# EAGLE schematic BottomBoard_Imu_Arduinio (EAGLE 9.4.2)

## Sheet 1 of 2
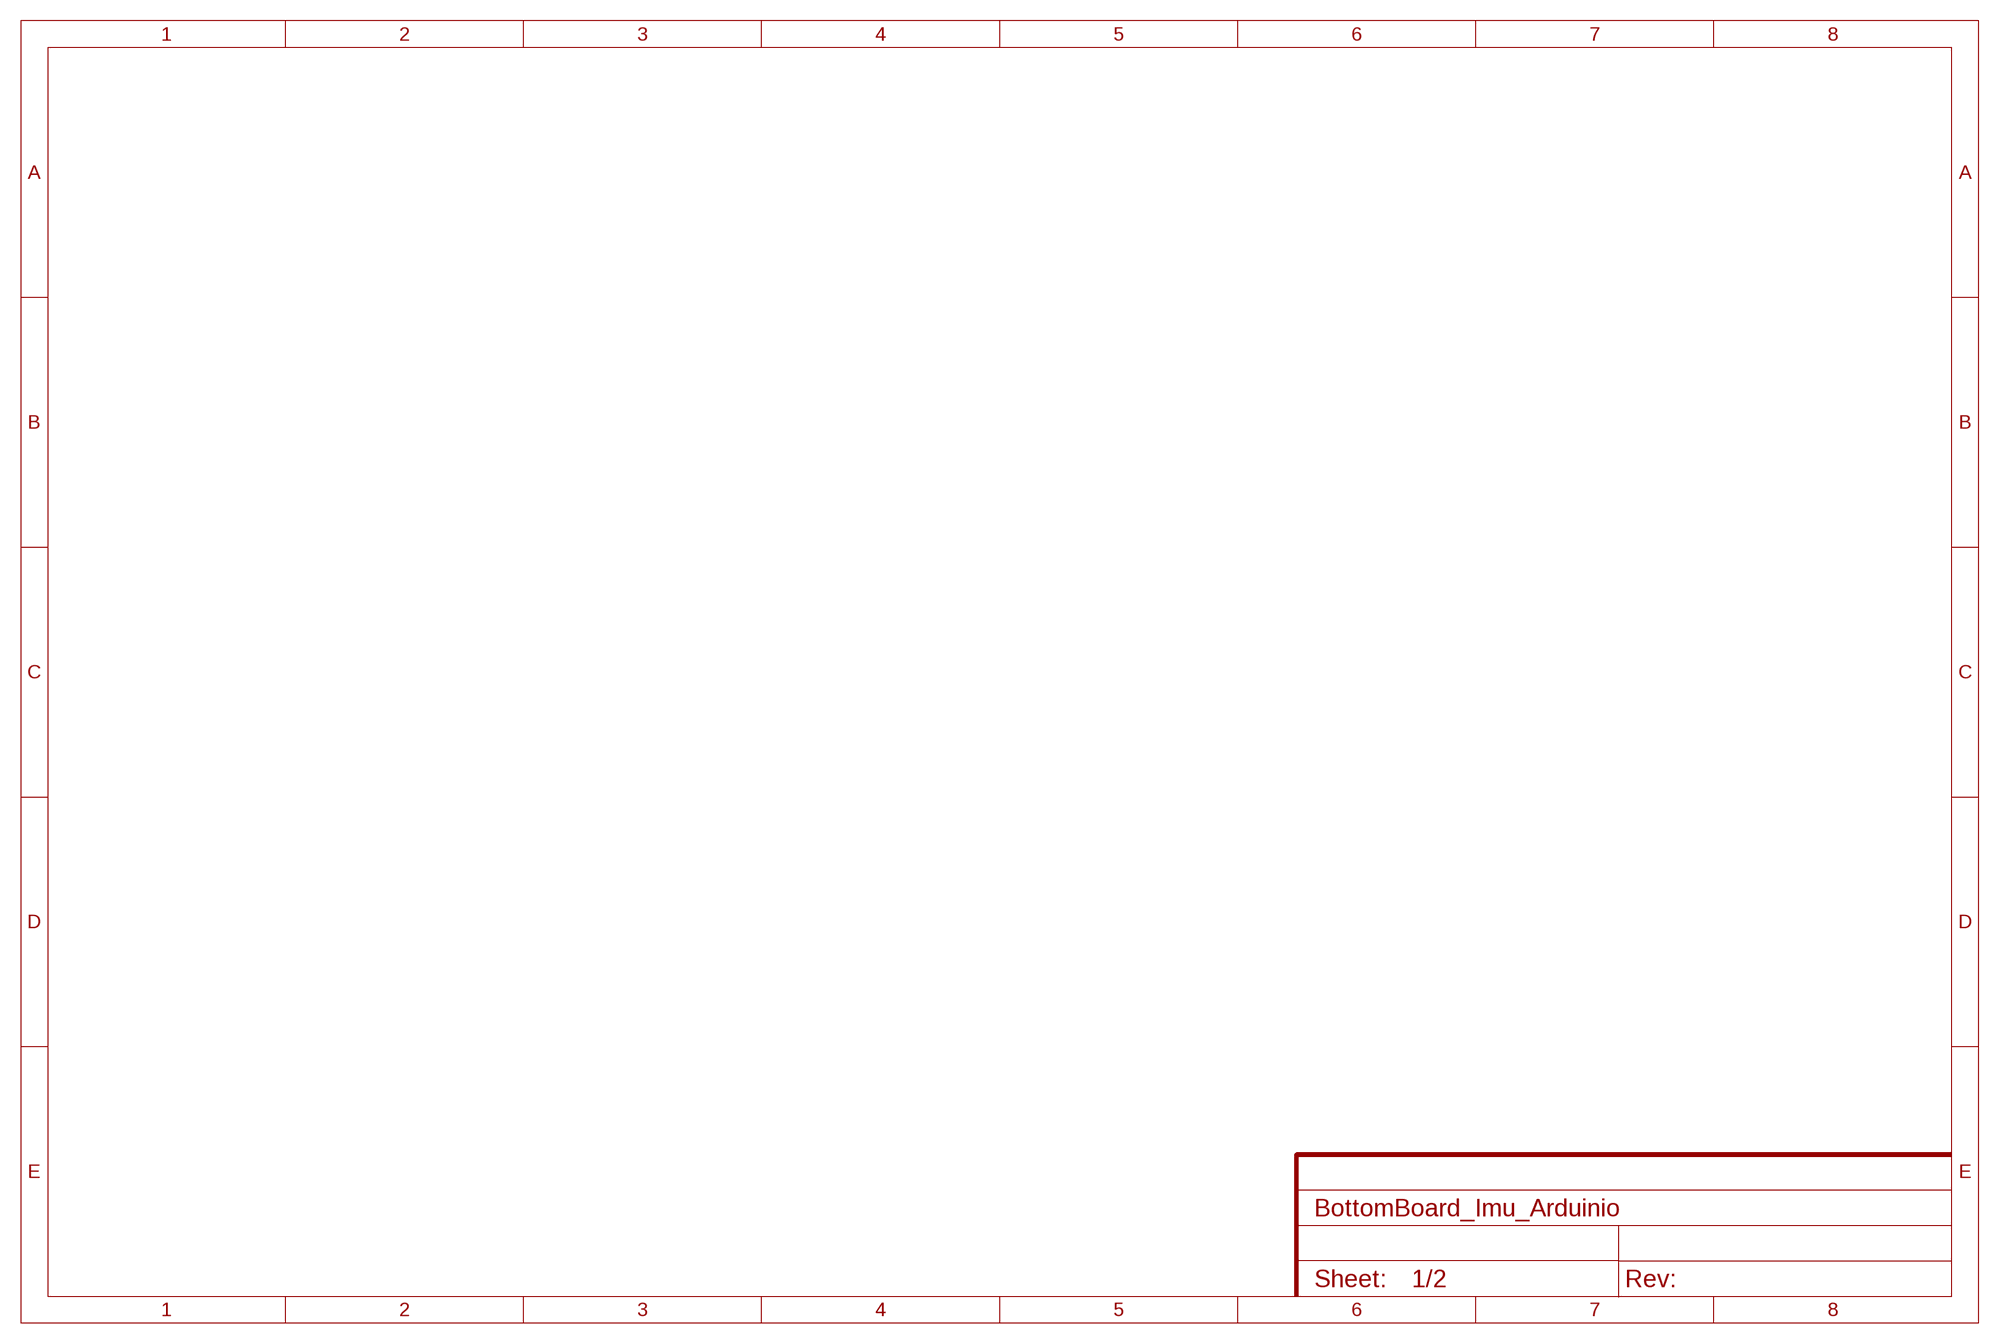
[diagram p0: schematic, sheet 1]

## Sheet 2 of 2
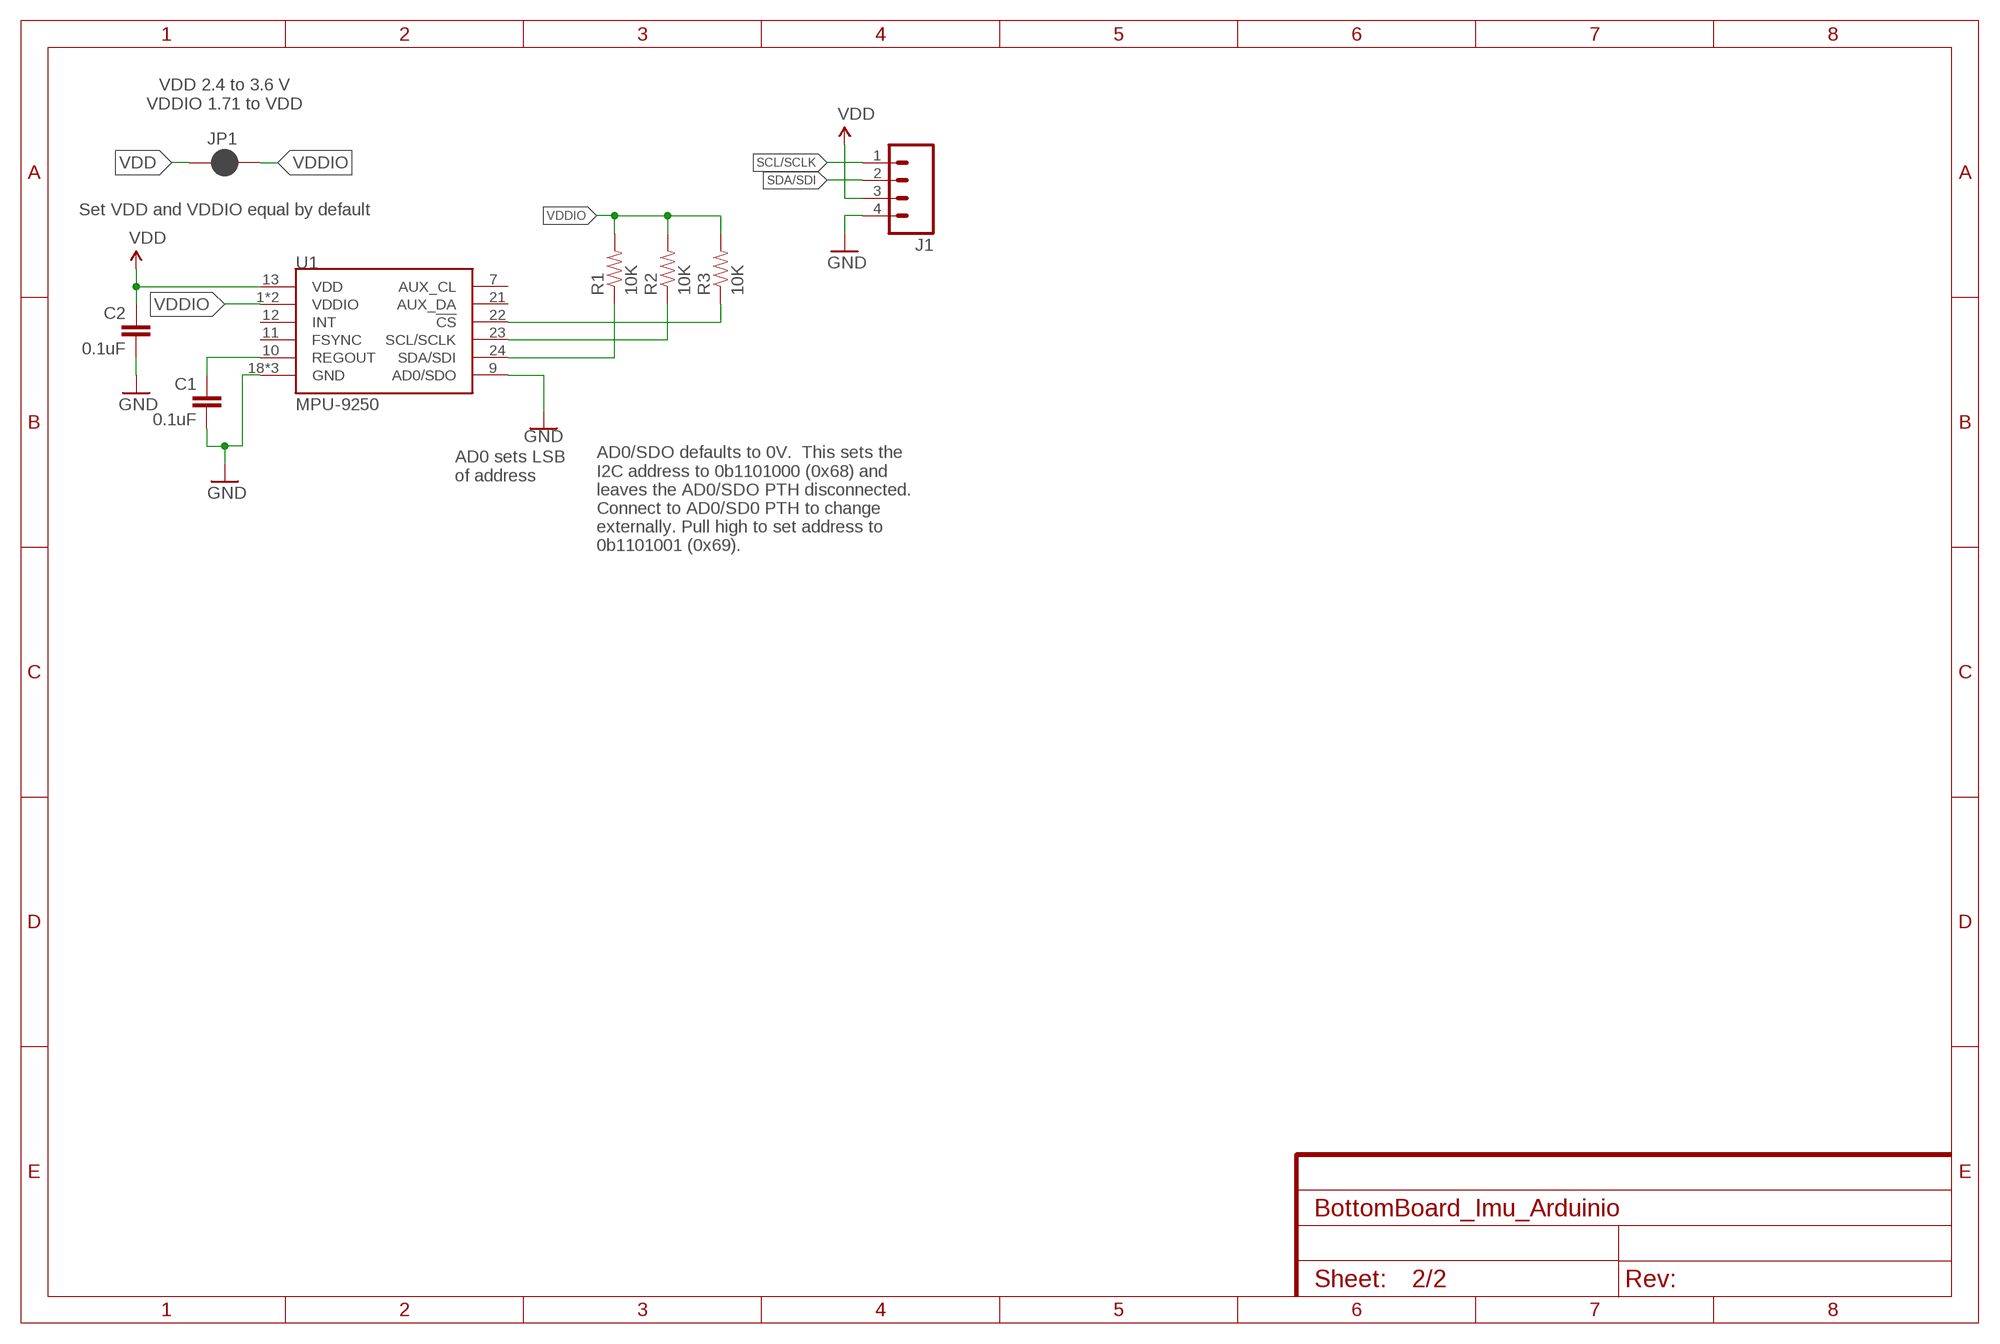
[diagram p1: schematic, sheet 2]

### Parts
C1  0.1uF  0.1UF-25V(+80/-20%)(0603)  [0603-CAP]
C2  0.1uF  0.1UF-25V(+80/-20%)(0603)  [0603-CAP]
J1  M04PTH  [1X04]
JP1  JUMPER-SMT_2_NC_PASTE_NO-SILK  [SMT-JUMPER_2_NC_PASTE_NO-SILK]
R1  10K  10KOHM-1/10W-1%(0603)0603  [0603-RES]
R2  10K  10KOHM-1/10W-1%(0603)0603  [0603-RES]
R3  10K  10KOHM-1/10W-1%(0603)0603  [0603-RES]
U1  MPU-9250  [QFN24_PAD]

### Nets
!CS: R3.1 U1.22(!CS)
GND: C1.2 C2.2 J1.4 U1.9(AD0/SDO) U1.18(GND) U1.20(GND) U1.CENTER(GND)
REGOUT: C1.1 U1.10(REGOUT)
SCL/SCLK: J1.1 R2.1 U1.23(SCL/SCLK)
SDA/SDI: J1.2 R1.1 U1.24(SDA/SDI)
VDD: C2.1 J1.3 JP1.1 U1.13(VDD)
VDDIO: JP1.2 R1.2 R2.2 R3.2 U1.1(VDDIO) U1.8(VDDIO)
Unconnected: U1.7(AUX_CL) U1.11(FSYNC) U1.12(INT) U1.21(AUX_DA)

### Notes on the sheet
- VDD 2.4 to 3.6 V
  VDDIO 1.71 to VDD
- Set VDD and VDDIO equal by default
- AD0/SDO defaults to 0V.  This sets the
  I2C address to 0b1101000 (0x68) and
  leaves the AD0/SDO PTH disconnected.
  Connect to AD0/SD0 PTH to change
  externally. Pull high to set address to
  0b1101001 (0x69).
- AD0 sets LSB
  of address

## Library data of the parts
C1 C2 = SparkFun-Capacitors:0.1UF-25V(+80/-20%)(0603): CAP-00810 Ceramic Standard decoupling cap; PROD_ID: CAP-00810
J1 = SparkFun-Connectors:M04: Header 4 Standard 4-pin 0.1" header. Use with straight break away headers (SKU : PRT-00116), right angle break away headers (PRT-00553), swiss pins (PRT-00743), machine pins (PRT-00117), and female headers (PRT-00115). Molex polarized connector foot print use with SKU : PRT-08231 with associated crimp pins and housings. 1MM SMD Version SKU: PRT-10208; PROD_ID: CONN-09696
JP1 = SparkFun-Jumpers:JUMPER-SMT_2_NC_PASTE: Normally closed solder jumper This jumper has an aperture in the stencil to allow solder paste to bridge the split in the wire so it's normally closed (NC). Wick off the solder to open the connection. Reapply solder to reclose the connection.
R1-R3 = SparkFun-Resistors:10KOHM-1/10W-1%(0603): RES-00824; PROD_ID: RES-00824
U1 = Testing:MPU-9250: NC pin 19. 2-6 & 14-17 not internally connected. May be used for PCB trace routing.; PROD_ID: IC-13192